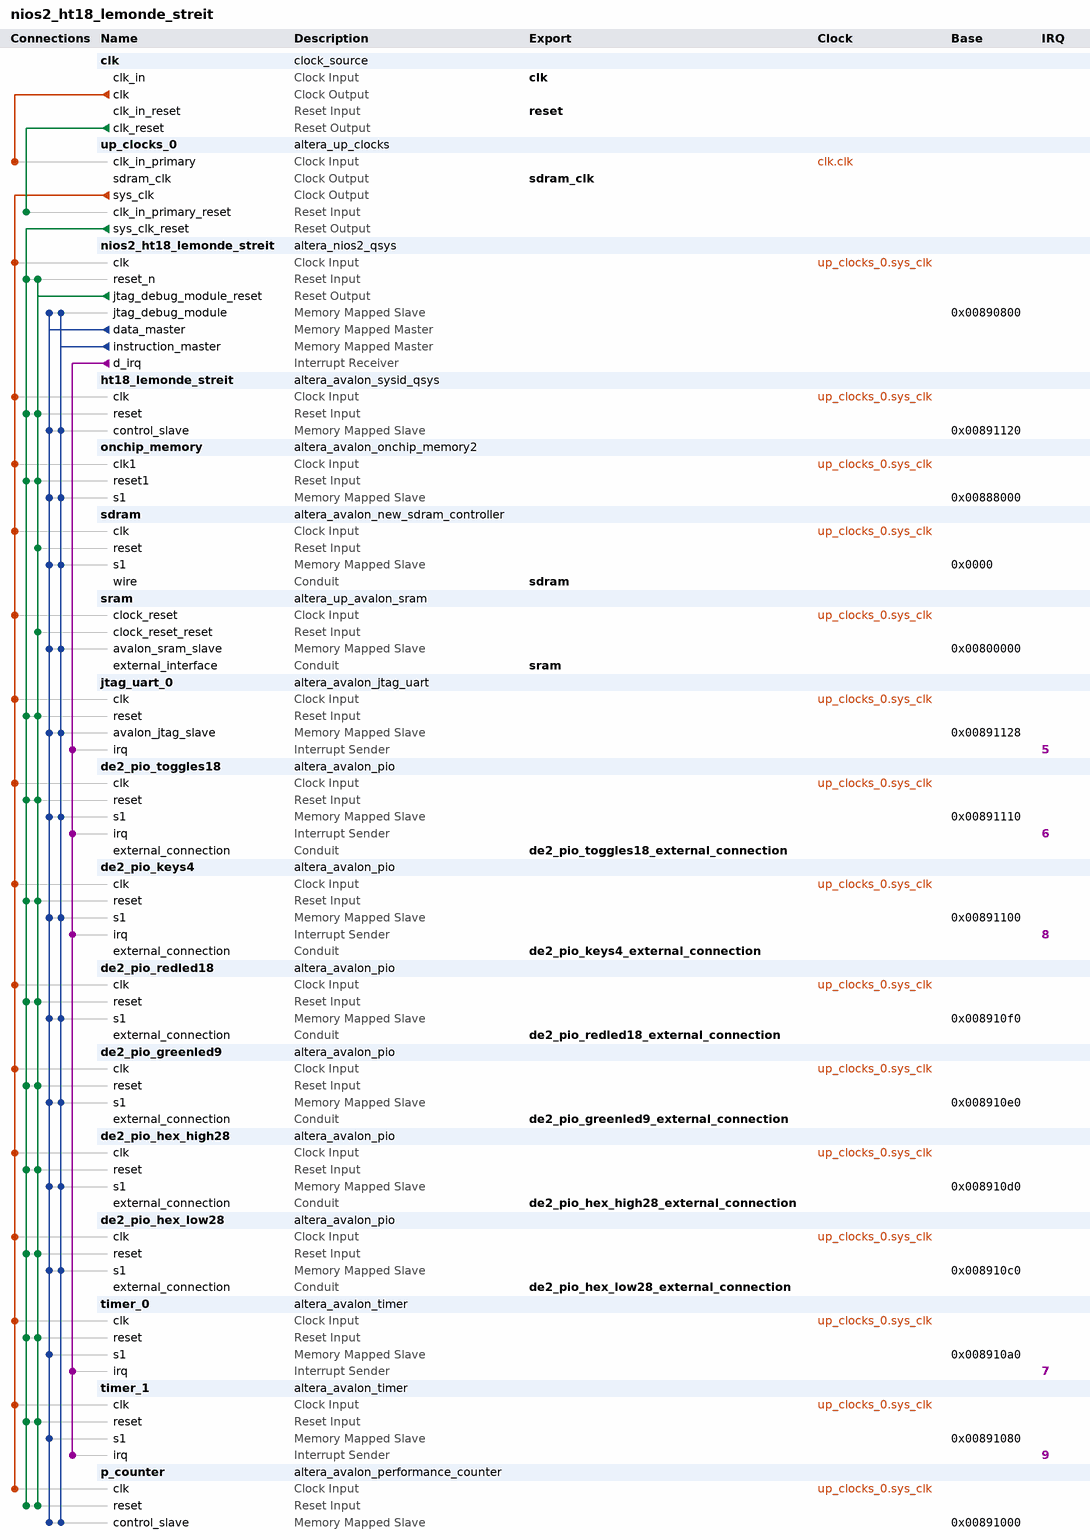
[diagram p0: system contents]
# Platform Designer (Qsys) system nios2_ht18_lemonde_streit, Cyclone II EP2C35F672C6
# Parameters at their usual value, and those the tool derives, are not listed.
package require -exact qsys 13.0.1.99.2
create_system nios2_ht18_lemonde_streit
set_project_property DEVICE_FAMILY {Cyclone II}
set_project_property DEVICE EP2C35F672C6

add_instance clk clock_source 13.0
set_instance_parameter_value clk clockFrequency 50000000

add_instance up_clocks_0 altera_up_clocks 13.0
set_instance_parameter_value up_clocks_0 board DE2
set_instance_parameter_value up_clocks_0 vga_clk false
set_instance_parameter_value up_clocks_0 audio_clk false
set_instance_parameter_value up_clocks_0 audio_clk_freq 12.288

add_instance nios2_ht18_lemonde_streit altera_nios2_qsys 13.0
set_instance_parameter_value nios2_ht18_lemonde_streit resetSlave sdram.s1
set_instance_parameter_value nios2_ht18_lemonde_streit mmu_TLBMissExcSlave None
set_instance_parameter_value nios2_ht18_lemonde_streit exceptionSlave sdram.s1
set_instance_parameter_value nios2_ht18_lemonde_streit breakSlave nios2_ht18_lemonde_streit.jtag_debug_module
set_instance_parameter_value nios2_ht18_lemonde_streit impl Tiny
set_instance_parameter_value nios2_ht18_lemonde_streit icache_size 4096

add_instance ht18_lemonde_streit altera_avalon_sysid_qsys 13.0
set_instance_parameter_value ht18_lemonde_streit id -912300509

add_instance onchip_memory altera_avalon_onchip_memory2 13.0.1.99.2
set_instance_parameter_value onchip_memory dataWidth 32
set_instance_parameter_value onchip_memory dualPort false
set_instance_parameter_value onchip_memory initMemContent true
set_instance_parameter_value onchip_memory initializationFileName onchip_mem.hex
set_instance_parameter_value onchip_memory memorySize 32768

add_instance sdram altera_avalon_new_sdram_controller 13.0.1.99.2
set_instance_parameter_value sdram TAC 5.5
set_instance_parameter_value sdram TRCD 20.0
set_instance_parameter_value sdram TRP 20.0
set_instance_parameter_value sdram casLatency 3
set_instance_parameter_value sdram columnWidth 8
set_instance_parameter_value sdram dataWidth 16
set_instance_parameter_value sdram generateSimulationModel false
set_instance_parameter_value sdram model single_Micron_MT48LC4M32B2_7_chip
set_instance_parameter_value sdram numberOfBanks 4
set_instance_parameter_value sdram numberOfChipSelects 1
set_instance_parameter_value sdram powerUpDelay 100.0
set_instance_parameter_value sdram refreshPeriod 15.625
set_instance_parameter_value sdram rowWidth 12

add_instance sram altera_up_avalon_sram 13.0
set_instance_parameter_value sram board DE2
set_instance_parameter_value sram pixel_buffer false

add_instance jtag_uart_0 altera_avalon_jtag_uart 13.0.1.99.2
set_instance_parameter_value jtag_uart_0 simInteractiveOptions NO_INTERACTIVE_WINDOWS

add_instance de2_pio_toggles18 altera_avalon_pio 13.0.1.99.2
set_instance_parameter_value de2_pio_toggles18 captureEdge true
set_instance_parameter_value de2_pio_toggles18 direction Input
set_instance_parameter_value de2_pio_toggles18 edgeType FALLING
set_instance_parameter_value de2_pio_toggles18 generateIRQ true
set_instance_parameter_value de2_pio_toggles18 irqType EDGE
set_instance_parameter_value de2_pio_toggles18 width 18

add_instance de2_pio_keys4 altera_avalon_pio 13.0.1.99.2
set_instance_parameter_value de2_pio_keys4 captureEdge true
set_instance_parameter_value de2_pio_keys4 direction Input
set_instance_parameter_value de2_pio_keys4 edgeType FALLING
set_instance_parameter_value de2_pio_keys4 generateIRQ true
set_instance_parameter_value de2_pio_keys4 irqType EDGE
set_instance_parameter_value de2_pio_keys4 width 4

add_instance de2_pio_redled18 altera_avalon_pio 13.0.1.99.2
set_instance_parameter_value de2_pio_redled18 direction Output
set_instance_parameter_value de2_pio_redled18 width 18

add_instance de2_pio_greenled9 altera_avalon_pio 13.0.1.99.2
set_instance_parameter_value de2_pio_greenled9 direction Output
set_instance_parameter_value de2_pio_greenled9 width 9

add_instance de2_pio_hex_high28 altera_avalon_pio 13.0.1.99.2
set_instance_parameter_value de2_pio_hex_high28 direction Output
set_instance_parameter_value de2_pio_hex_high28 width 28

add_instance de2_pio_hex_low28 altera_avalon_pio 13.0.1.99.2
set_instance_parameter_value de2_pio_hex_low28 direction Output
set_instance_parameter_value de2_pio_hex_low28 width 28

add_instance timer_0 altera_avalon_timer 13.0.1.99.2
set_instance_parameter_value timer_0 period 1
set_instance_parameter_value timer_0 periodUnits MSEC

add_instance timer_1 altera_avalon_timer 13.0.1.99.2
set_instance_parameter_value timer_1 period 2
set_instance_parameter_value timer_1 periodUnits MSEC

add_instance p_counter altera_avalon_performance_counter 13.0.1.99.2
set_instance_parameter_value p_counter numberOfSections 7

# connections
add_connection clk.clk up_clocks_0.clk_in_primary clock
add_connection up_clocks_0.sys_clk de2_pio_greenled9.clk clock
add_connection up_clocks_0.sys_clk de2_pio_hex_high28.clk clock
add_connection up_clocks_0.sys_clk de2_pio_hex_low28.clk clock
add_connection up_clocks_0.sys_clk de2_pio_keys4.clk clock
add_connection up_clocks_0.sys_clk de2_pio_redled18.clk clock
add_connection up_clocks_0.sys_clk de2_pio_toggles18.clk clock
add_connection up_clocks_0.sys_clk ht18_lemonde_streit.clk clock
add_connection up_clocks_0.sys_clk jtag_uart_0.clk clock
add_connection up_clocks_0.sys_clk nios2_ht18_lemonde_streit.clk clock
add_connection up_clocks_0.sys_clk onchip_memory.clk1 clock
add_connection up_clocks_0.sys_clk p_counter.clk clock
add_connection up_clocks_0.sys_clk sdram.clk clock
add_connection up_clocks_0.sys_clk sram.clock_reset clock
add_connection up_clocks_0.sys_clk timer_0.clk clock
add_connection up_clocks_0.sys_clk timer_1.clk clock
add_connection clk.clk_reset up_clocks_0.clk_in_primary_reset reset
add_connection nios2_ht18_lemonde_streit.jtag_debug_module_reset de2_pio_greenled9.reset reset
add_connection nios2_ht18_lemonde_streit.jtag_debug_module_reset de2_pio_hex_high28.reset reset
add_connection nios2_ht18_lemonde_streit.jtag_debug_module_reset de2_pio_hex_low28.reset reset
add_connection nios2_ht18_lemonde_streit.jtag_debug_module_reset de2_pio_keys4.reset reset
add_connection nios2_ht18_lemonde_streit.jtag_debug_module_reset de2_pio_redled18.reset reset
add_connection nios2_ht18_lemonde_streit.jtag_debug_module_reset de2_pio_toggles18.reset reset
add_connection nios2_ht18_lemonde_streit.jtag_debug_module_reset ht18_lemonde_streit.reset reset
add_connection nios2_ht18_lemonde_streit.jtag_debug_module_reset jtag_uart_0.reset reset
add_connection nios2_ht18_lemonde_streit.jtag_debug_module_reset nios2_ht18_lemonde_streit.reset_n reset
add_connection nios2_ht18_lemonde_streit.jtag_debug_module_reset onchip_memory.reset1 reset
add_connection nios2_ht18_lemonde_streit.jtag_debug_module_reset p_counter.reset reset
add_connection nios2_ht18_lemonde_streit.jtag_debug_module_reset sdram.reset reset
add_connection nios2_ht18_lemonde_streit.jtag_debug_module_reset sram.clock_reset_reset reset
add_connection nios2_ht18_lemonde_streit.jtag_debug_module_reset timer_0.reset reset
add_connection nios2_ht18_lemonde_streit.jtag_debug_module_reset timer_1.reset reset
add_connection up_clocks_0.sys_clk_reset de2_pio_greenled9.reset reset
add_connection up_clocks_0.sys_clk_reset de2_pio_hex_high28.reset reset
add_connection up_clocks_0.sys_clk_reset de2_pio_hex_low28.reset reset
add_connection up_clocks_0.sys_clk_reset de2_pio_keys4.reset reset
add_connection up_clocks_0.sys_clk_reset de2_pio_redled18.reset reset
add_connection up_clocks_0.sys_clk_reset de2_pio_toggles18.reset reset
add_connection up_clocks_0.sys_clk_reset ht18_lemonde_streit.reset reset
add_connection up_clocks_0.sys_clk_reset jtag_uart_0.reset reset
add_connection up_clocks_0.sys_clk_reset nios2_ht18_lemonde_streit.reset_n reset
add_connection up_clocks_0.sys_clk_reset onchip_memory.reset1 reset
add_connection up_clocks_0.sys_clk_reset p_counter.reset reset
add_connection up_clocks_0.sys_clk_reset timer_0.reset reset
add_connection up_clocks_0.sys_clk_reset timer_1.reset reset
add_connection nios2_ht18_lemonde_streit.data_master de2_pio_greenled9.s1 avalon
set_connection_parameter_value nios2_ht18_lemonde_streit.data_master/de2_pio_greenled9.s1 baseAddress 0x008910e0
add_connection nios2_ht18_lemonde_streit.data_master de2_pio_hex_high28.s1 avalon
set_connection_parameter_value nios2_ht18_lemonde_streit.data_master/de2_pio_hex_high28.s1 baseAddress 0x008910d0
add_connection nios2_ht18_lemonde_streit.data_master de2_pio_hex_low28.s1 avalon
set_connection_parameter_value nios2_ht18_lemonde_streit.data_master/de2_pio_hex_low28.s1 baseAddress 0x008910c0
add_connection nios2_ht18_lemonde_streit.data_master de2_pio_keys4.s1 avalon
set_connection_parameter_value nios2_ht18_lemonde_streit.data_master/de2_pio_keys4.s1 baseAddress 0x00891100
add_connection nios2_ht18_lemonde_streit.data_master de2_pio_redled18.s1 avalon
set_connection_parameter_value nios2_ht18_lemonde_streit.data_master/de2_pio_redled18.s1 baseAddress 0x008910f0
add_connection nios2_ht18_lemonde_streit.data_master de2_pio_toggles18.s1 avalon
set_connection_parameter_value nios2_ht18_lemonde_streit.data_master/de2_pio_toggles18.s1 baseAddress 0x00891110
add_connection nios2_ht18_lemonde_streit.data_master ht18_lemonde_streit.control_slave avalon
set_connection_parameter_value nios2_ht18_lemonde_streit.data_master/ht18_lemonde_streit.control_slave baseAddress 0x00891120
add_connection nios2_ht18_lemonde_streit.data_master jtag_uart_0.avalon_jtag_slave avalon
set_connection_parameter_value nios2_ht18_lemonde_streit.data_master/jtag_uart_0.avalon_jtag_slave baseAddress 0x00891128
add_connection nios2_ht18_lemonde_streit.data_master nios2_ht18_lemonde_streit.jtag_debug_module avalon
set_connection_parameter_value nios2_ht18_lemonde_streit.data_master/nios2_ht18_lemonde_streit.jtag_debug_module baseAddress 0x00890800
add_connection nios2_ht18_lemonde_streit.data_master onchip_memory.s1 avalon
set_connection_parameter_value nios2_ht18_lemonde_streit.data_master/onchip_memory.s1 baseAddress 0x00888000
add_connection nios2_ht18_lemonde_streit.data_master p_counter.control_slave avalon
set_connection_parameter_value nios2_ht18_lemonde_streit.data_master/p_counter.control_slave baseAddress 0x00891000
add_connection nios2_ht18_lemonde_streit.data_master sdram.s1 avalon
set_connection_parameter_value nios2_ht18_lemonde_streit.data_master/sdram.s1 baseAddress 0x0000
add_connection nios2_ht18_lemonde_streit.data_master sram.avalon_sram_slave avalon
set_connection_parameter_value nios2_ht18_lemonde_streit.data_master/sram.avalon_sram_slave baseAddress 0x00800000
add_connection nios2_ht18_lemonde_streit.data_master timer_0.s1 avalon
set_connection_parameter_value nios2_ht18_lemonde_streit.data_master/timer_0.s1 baseAddress 0x008910a0
add_connection nios2_ht18_lemonde_streit.data_master timer_1.s1 avalon
set_connection_parameter_value nios2_ht18_lemonde_streit.data_master/timer_1.s1 baseAddress 0x00891080
add_connection nios2_ht18_lemonde_streit.instruction_master de2_pio_greenled9.s1 avalon
set_connection_parameter_value nios2_ht18_lemonde_streit.instruction_master/de2_pio_greenled9.s1 baseAddress 0x008910e0
add_connection nios2_ht18_lemonde_streit.instruction_master de2_pio_hex_high28.s1 avalon
set_connection_parameter_value nios2_ht18_lemonde_streit.instruction_master/de2_pio_hex_high28.s1 baseAddress 0x008910d0
add_connection nios2_ht18_lemonde_streit.instruction_master de2_pio_hex_low28.s1 avalon
set_connection_parameter_value nios2_ht18_lemonde_streit.instruction_master/de2_pio_hex_low28.s1 baseAddress 0x008910c0
add_connection nios2_ht18_lemonde_streit.instruction_master de2_pio_keys4.s1 avalon
set_connection_parameter_value nios2_ht18_lemonde_streit.instruction_master/de2_pio_keys4.s1 baseAddress 0x00891100
add_connection nios2_ht18_lemonde_streit.instruction_master de2_pio_redled18.s1 avalon
set_connection_parameter_value nios2_ht18_lemonde_streit.instruction_master/de2_pio_redled18.s1 baseAddress 0x008910f0
add_connection nios2_ht18_lemonde_streit.instruction_master de2_pio_toggles18.s1 avalon
set_connection_parameter_value nios2_ht18_lemonde_streit.instruction_master/de2_pio_toggles18.s1 baseAddress 0x00891110
add_connection nios2_ht18_lemonde_streit.instruction_master ht18_lemonde_streit.control_slave avalon
set_connection_parameter_value nios2_ht18_lemonde_streit.instruction_master/ht18_lemonde_streit.control_slave baseAddress 0x00891120
add_connection nios2_ht18_lemonde_streit.instruction_master jtag_uart_0.avalon_jtag_slave avalon
set_connection_parameter_value nios2_ht18_lemonde_streit.instruction_master/jtag_uart_0.avalon_jtag_slave baseAddress 0x00891128
add_connection nios2_ht18_lemonde_streit.instruction_master nios2_ht18_lemonde_streit.jtag_debug_module avalon
set_connection_parameter_value nios2_ht18_lemonde_streit.instruction_master/nios2_ht18_lemonde_streit.jtag_debug_module baseAddress 0x00890800
add_connection nios2_ht18_lemonde_streit.instruction_master onchip_memory.s1 avalon
set_connection_parameter_value nios2_ht18_lemonde_streit.instruction_master/onchip_memory.s1 baseAddress 0x00888000
add_connection nios2_ht18_lemonde_streit.instruction_master p_counter.control_slave avalon
set_connection_parameter_value nios2_ht18_lemonde_streit.instruction_master/p_counter.control_slave baseAddress 0x00891000
add_connection nios2_ht18_lemonde_streit.instruction_master sdram.s1 avalon
set_connection_parameter_value nios2_ht18_lemonde_streit.instruction_master/sdram.s1 baseAddress 0x0000
add_connection nios2_ht18_lemonde_streit.instruction_master sram.avalon_sram_slave avalon
set_connection_parameter_value nios2_ht18_lemonde_streit.instruction_master/sram.avalon_sram_slave baseAddress 0x00800000
add_connection nios2_ht18_lemonde_streit.d_irq de2_pio_keys4.irq interrupt
set_connection_parameter_value nios2_ht18_lemonde_streit.d_irq/de2_pio_keys4.irq irqNumber 8
add_connection nios2_ht18_lemonde_streit.d_irq de2_pio_toggles18.irq interrupt
set_connection_parameter_value nios2_ht18_lemonde_streit.d_irq/de2_pio_toggles18.irq irqNumber 6
add_connection nios2_ht18_lemonde_streit.d_irq jtag_uart_0.irq interrupt
set_connection_parameter_value nios2_ht18_lemonde_streit.d_irq/jtag_uart_0.irq irqNumber 5
add_connection nios2_ht18_lemonde_streit.d_irq timer_0.irq interrupt
set_connection_parameter_value nios2_ht18_lemonde_streit.d_irq/timer_0.irq irqNumber 7
add_connection nios2_ht18_lemonde_streit.d_irq timer_1.irq interrupt
set_connection_parameter_value nios2_ht18_lemonde_streit.d_irq/timer_1.irq irqNumber 9

# exported interfaces
add_interface clk clock sink
set_interface_property clk EXPORT_OF clk.clk_in
add_interface de2_pio_toggles18_external_connection conduit end
set_interface_property de2_pio_toggles18_external_connection EXPORT_OF de2_pio_toggles18.external_connection
add_interface de2_pio_keys4_external_connection conduit end
set_interface_property de2_pio_keys4_external_connection EXPORT_OF de2_pio_keys4.external_connection
add_interface de2_pio_redled18_external_connection conduit end
set_interface_property de2_pio_redled18_external_connection EXPORT_OF de2_pio_redled18.external_connection
add_interface de2_pio_greenled9_external_connection conduit end
set_interface_property de2_pio_greenled9_external_connection EXPORT_OF de2_pio_greenled9.external_connection
add_interface de2_pio_hex_low28_external_connection conduit end
set_interface_property de2_pio_hex_low28_external_connection EXPORT_OF de2_pio_hex_low28.external_connection
add_interface de2_pio_hex_high28_external_connection conduit end
set_interface_property de2_pio_hex_high28_external_connection EXPORT_OF de2_pio_hex_high28.external_connection
add_interface sdram conduit end
set_interface_property sdram EXPORT_OF sdram.wire
add_interface sram conduit end
set_interface_property sram EXPORT_OF sram.external_interface
add_interface reset reset sink
set_interface_property reset EXPORT_OF clk.clk_in_reset
add_interface sdram_clk clock source
set_interface_property sdram_clk EXPORT_OF up_clocks_0.sdram_clk

set_interconnect_requirement {$system} qsys_mm.clockCrossingAdapter HANDSHAKE
set_interconnect_requirement {$system} qsys_mm.maxAdditionalLatency 1

save_system nios2_ht18_lemonde_streit.qsys
